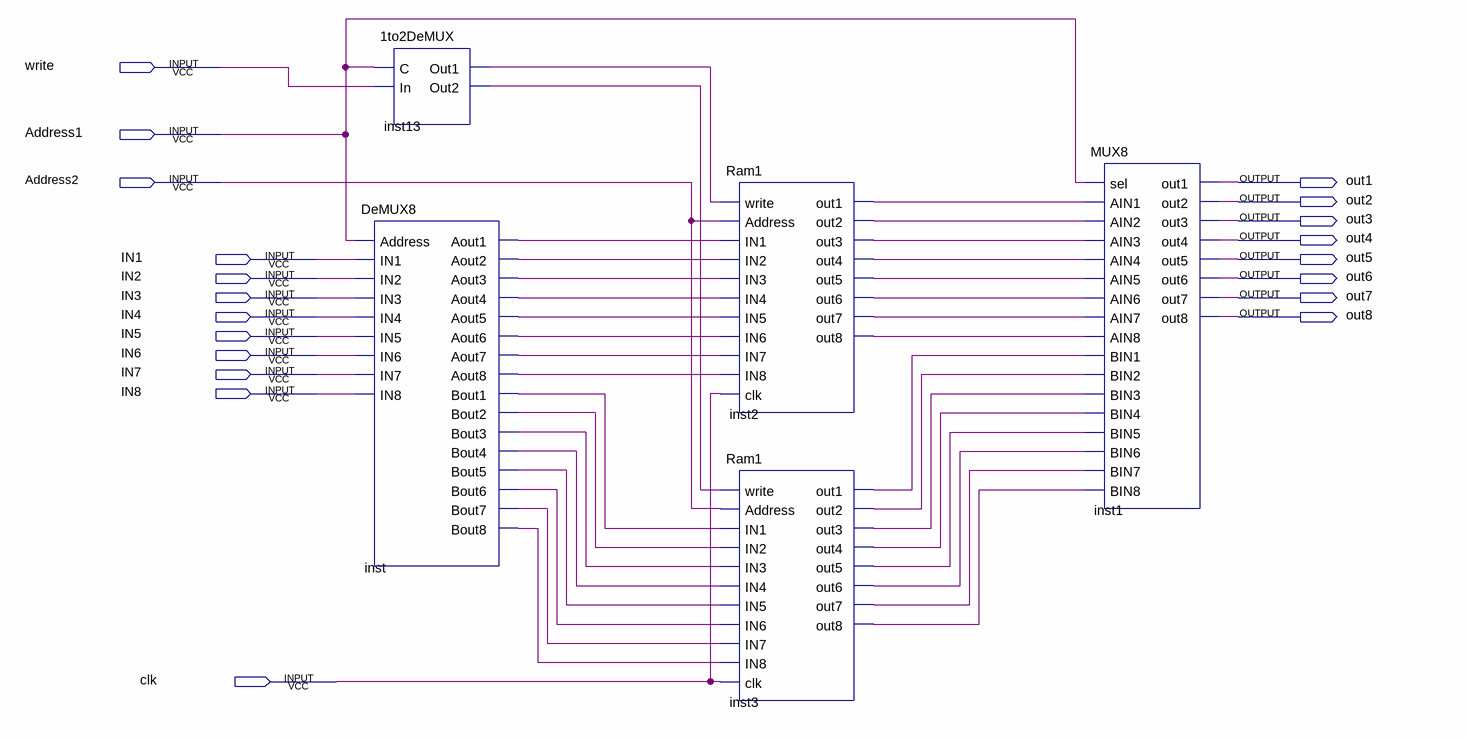
[diagram p0: schematic sheet]
// Quartus schematic Ram2.bdf as structural Verilog: 5 symbols, 20 pins
module Ram2 (
  input  write,
  input  Address1,
  input  Address2,
  input  IN1,
  input  IN2,
  input  IN3,
  input  IN4,
  input  IN5,
  input  IN6,
  input  IN7,
  input  IN8,
  input  clk,
  output out1,
  output out2,
  output out3,
  output out4,
  output out5,
  output out6,
  output out7,
  output out8
);

  wire inst2_out1, inst2_out2, inst2_out3, inst2_out4, inst2_out5, inst2_out6, inst2_out7, inst2_out8,
       inst3_out1, inst3_out2, inst3_out3, inst3_out4, inst3_out5, inst3_out6, inst3_out7, inst3_out8,
       inst13_out1, inst13_out2, inst_aout1, inst_aout2, inst_aout3, inst_aout4, inst_aout5, inst_aout6,
       inst_aout7, inst_aout8, inst_bout1, inst_bout2, inst_bout3, inst_bout4, inst_bout5, inst_bout6,
       inst_bout7, inst_bout8;

  \1to2DeMUX  inst13 (.C(Address1), .In(write), .Out1(inst13_out1), .Out2(inst13_out2));
  DeMUX8 inst (
    .Address(Address1), .IN1(IN1), .IN2(IN2), .IN3(IN3), .IN4(IN4), .IN5(IN5), .IN6(IN6), .IN7(IN7),
    .IN8(IN8), .Aout1(inst_aout1), .Aout2(inst_aout2), .Aout3(inst_aout3), .Aout4(inst_aout4),
    .Aout5(inst_aout5), .Aout6(inst_aout6), .Aout7(inst_aout7), .Aout8(inst_aout8), .Bout1(inst_bout1),
    .Bout2(inst_bout2), .Bout3(inst_bout3), .Bout4(inst_bout4), .Bout5(inst_bout5), .Bout6(inst_bout6),
    .Bout7(inst_bout7), .Bout8(inst_bout8));
  Ram1 inst2 (
    .write(inst13_out1), .Address(Address2), .IN1(inst_aout1), .IN2(inst_aout2), .IN3(inst_aout3),
    .IN4(inst_aout4), .IN5(inst_aout5), .IN6(inst_aout6), .IN7(inst_aout7), .IN8(inst_aout8), .clk(clk),
    .out1(inst2_out1), .out2(inst2_out2), .out3(inst2_out3), .out4(inst2_out4), .out5(inst2_out5),
    .out6(inst2_out6), .out7(inst2_out7), .out8(inst2_out8));
  Ram1 inst3 (
    .write(inst13_out2), .Address(Address2), .IN1(inst_bout1), .IN2(inst_bout2), .IN3(inst_bout3),
    .IN4(inst_bout4), .IN5(inst_bout5), .IN6(inst_bout6), .IN7(inst_bout7), .IN8(inst_bout8), .clk(clk),
    .out1(inst3_out1), .out2(inst3_out2), .out3(inst3_out3), .out4(inst3_out4), .out5(inst3_out5),
    .out6(inst3_out6), .out7(inst3_out7), .out8(inst3_out8));
  MUX8 inst1 (
    .sel(Address1), .AIN1(inst2_out1), .AIN2(inst2_out2), .AIN3(inst2_out3), .AIN4(inst2_out4),
    .AIN5(inst2_out5), .AIN6(inst2_out6), .AIN7(inst2_out7), .AIN8(inst2_out8), .BIN1(inst3_out1),
    .BIN2(inst3_out2), .BIN3(inst3_out3), .BIN4(inst3_out4), .BIN5(inst3_out5), .BIN6(inst3_out6),
    .BIN7(inst3_out7), .BIN8(inst3_out8), .out1(out1), .out2(out2), .out3(out3), .out4(out4), .out5(out5),
    .out6(out6), .out7(out7), .out8(out8));
endmodule
